# Altium project IC_tester.PrjPcb
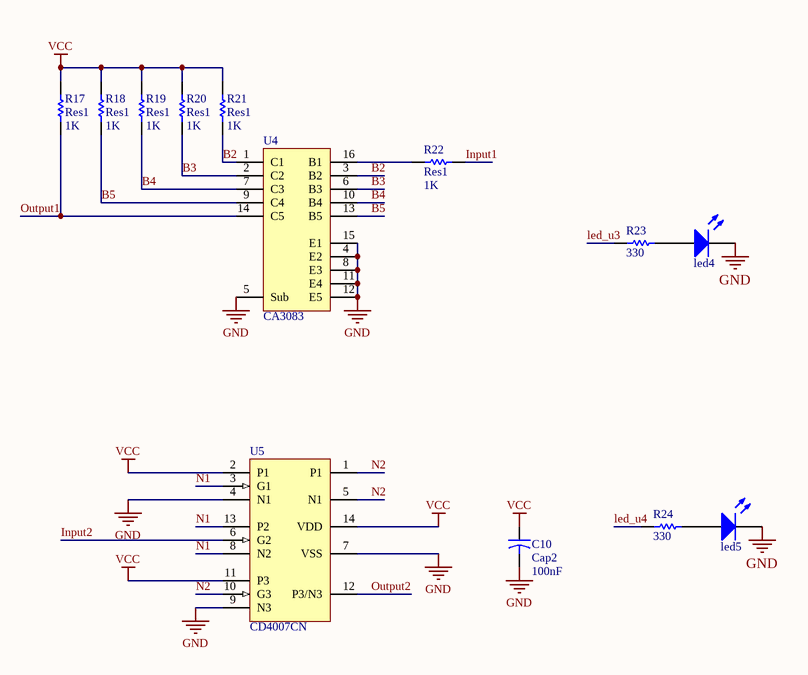
[diagram p0: Az_Proj.SchDoc]
3 sheets, 62 parts. Net scope: global (net labels, ports and power ports of the same name join across sheets).
Board file: ICtester.PcbDoc
Sheets:
  Az_Proj.SchDoc
  main.SchDoc
  power2.SchDoc

## Sheet Az_Proj.SchDoc
size A

### Parts
C10  Cap2  value 100nF  [My_cap100n]
led4  LED 5mm  [LED-5mm]  (value not drawn)
led5  LED 5mm  [LED-5mm]  (value not drawn)
R17  Res1  value 1K  [AXIAL-0.3]
R18  Res1  value 1K  [AXIAL-0.3]
R19  Res1  value 1K  [AXIAL-0.3]
R20  Res1  value 1K  [AXIAL-0.3]
R21  Res1  value 1K  [AXIAL-0.3]
R22  Res1  value 1K  [AXIAL-0.3]
R23  value 330  [AXIAL-0.3]  (hidden comment: Res1)
R24  value 330  [AXIAL-0.3]  (hidden comment: Res1)
U4  CA3083  [DIP16]
U5  CD4007CN  [DIP14]

### Nets
GND: C10.2 led4.2(K) led5.2(K) U4.4(E2) U4.5(Sub) U4.8(E3) U4.11(E4) U4.12(E5) U4.15(E1) U5.4(N1) U5.7(VSS) U5.9(N3)
VCC: C10.1 R17.2 R18.2 R19.2 R20.2 R21.2 U5.2(P1) U5.11(P3) U5.14(VDD)
B2: R21.1 U4.1(C1) U4.3(B2)
B3: R20.1 U4.2(C2) U4.6(B3)
B4: R19.1 U4.7(C3) U4.10(B4)
B5: R18.1 U4.9(C4) U4.13(B5)
Input1: R22.2
Input2: U5.6(G2)
led_u3: R23.1
led_u4: R24.1
N1: U5.3(G1) U5.8(N2) U5.13(P2)
N2: U5.1(P1) U5.5(N1) U5.10(G3)
Output1: R17.1 U4.14(C5)
Output2: U5.12(P3/N3)
Netled4_1: led4.1(A) R23.2
Netled5_1: led5.1(A) R24.2
NetR22_1: R22.1 U4.16(B1)

### Library data of the parts
C10 = Cap2: Capacitor; Published: 23-Sep-2002; PackageReference: CAPR5-4X5; Publisher: Altium Limited; PackageDescription: Capacitor; 2 Leads
led4 led5 = LED 5mm: Typical LED; Designer: Seyed Mohsen Ghasemian; Published: 07/31/2012; PackageReference: LED; Publisher: www.picpars.com; PackageDescription: LED; 2 Leads
R17-R24 = Res1: Resistor; Published: 8-Jun-2000; LatestRevisionDate: 17-Jul-2002; LatestRevisionNote: Re-released for DXP Platform.; PackageReference: AXIAL-0.3; Publisher: Altium Limited; PackageDescription: Axial Device, Thru-Hole; 2 Leads; 0.3 in Pin Spacing
U5 = CD4007CN: Dual Complementary Pair Plus Inverter; Published: 17-Jul-2002; LatestRevisionDate: 29-May-2009; LatestRevisionNote: Component Body Added.; DatasheetVersion: Jan-1999; PackageVersion: 2000; PackageReference: N14A; Publisher: Altium Limited; PackageDescription: DIP, 14-Pin, Row Spacing 7.62 mm, Pitch 2.54 mm; ComponentLink1Description: Manufacturer Link; ComponentLink1URL: http://www.fairchildsemi.com/

## Sheet main.SchDoc
size A
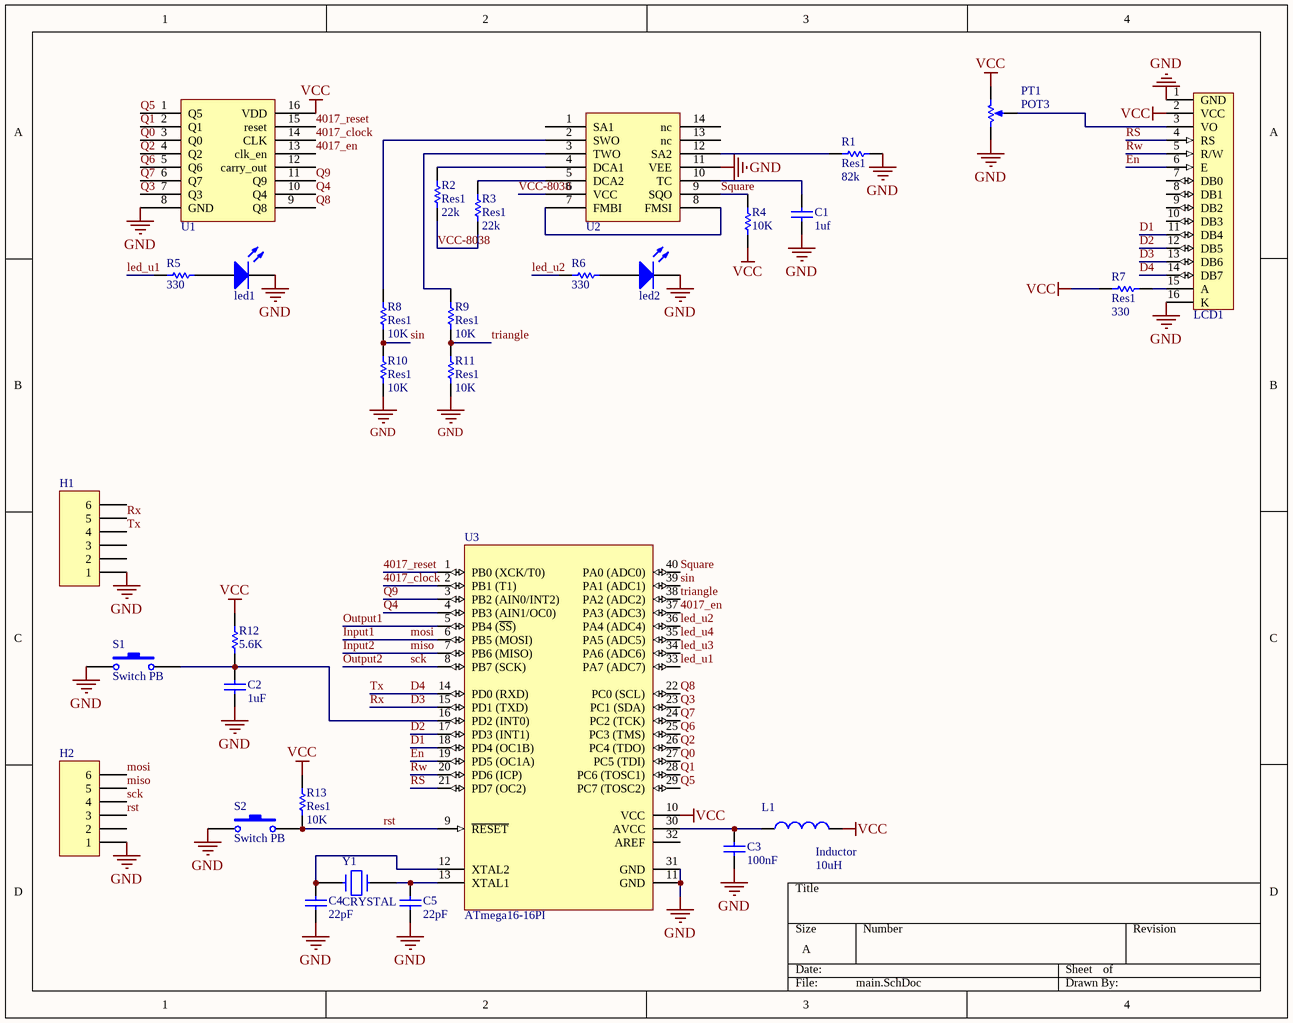
[diagram p1: main.SchDoc]

### Parts
C1  value 1uf  [My_cap100n]  (hidden comment: Cap-NF)
C2  value 1uF  [My_cap100n]  (hidden comment: Cap-NF)
C3  value 100nF  [My_cap100n]  (hidden comment: Cap-NF)
C4  value 22pF  [My_cap100n]  (hidden comment: Cap-NF)
C5  value 22pF  [My_cap100n]  (hidden comment: Cap-NF)
H1  Header 6  [My_1X06]  (value not drawn)
H2  Header 6  [My_1X06]  (value not drawn)
L1  Inductor  value 10uH  [AXIAL-0.4]
LCD1  LCD 16X2  [LCD 16x2]  (value not drawn)
led1  LED 5mm  [LED-5mm]  (value not drawn)
led2  LED 5mm  [LED-5mm]  (value not drawn)
PT1  POT3  [POT3]
R1  Res1  value 82k  [AXIAL-0.3]
R2  Res1  value 22k  [AXIAL-0.3]
R3  Res1  value 22k  [AXIAL-0.3]
R4  value 10K  [AXIAL-0.3]  (hidden comment: Res1)
R5  value 330  [AXIAL-0.3]  (hidden comment: Res1)
R6  value 330  [AXIAL-0.3]  (hidden comment: Res1)
R7  Res1  value 330  [AXIAL-0.3]
R8  Res1  value 10K  [AXIAL-0.3]
R9  Res1  value 10K  [AXIAL-0.3]
R10  Res1  value 10K  [AXIAL-0.3]
R11  Res1  value 10K  [AXIAL-0.3]
R12  value 5.6K  [AXIAL-0.3]  (hidden comment: Res1)
R13  Res1  value 10K  [AXIAL-0.3]
S1  Switch PB  [Switch - Push to On]
S2  Switch PB  [Switch - Push to On]
U1  4017  [DIP16]  (value not drawn)
U2  xr8038  [DIP14]  (value not drawn)
U3  ATmega16-16PI  [My_40P6]
Y1  CRYSTAL  [My_Crystal]

### Nets
GND: C1.1 C2.1 C3.2 C4.2 C5.2 H1.1 H2.1 LCD1.1(GND) LCD1.16(K) led1.2(K) led2.2(K) PT1.2(BOT) R1.2 R10.1 R11.1 S1.1 S2.1 U1.8(GND) U2.11(VEE) U3.11(GND) U3.31(GND)
VCC: L1.2 LCD1.2(VCC) PT1.1(TOP) R4.1 R7.1 R12.1 R13.2 U1.16(VDD) U3.10(VCC)
4017_clock: U1.14(CLK) U3.2(PB1_(T1))
4017_en: U1.13(clk_en) U3.37(PA3_(ADC3))
4017_reset: U1.15(reset) U3.1(PB0_(XCK/T0))
D1: LCD1.11(DB4) U3.18(PD4_(OC1B))
D2: LCD1.12(DB5) U3.17(PD3_(INT1))
D3: H1.5 LCD1.13(DB6) U3.15(PD1_(TXD))  [also labelled Rx]
D4: H1.4 LCD1.14(DB7) U3.14(PD0_(RXD))  [also labelled Tx]
En: LCD1.6(E) U3.19(PD5_(OC1A))
Input1: H2.6 U3.6(PB5_(MOSI))  [also labelled mosi]
Input2: H2.5 U3.7(PB6_(MISO))  [also labelled miso]
led_u1: R5.1 U3.33(PA7_(ADC7))
led_u2: R6.1 U3.36(PA4_(ADC4))
led_u3: U3.34(PA6_(ADC6))
led_u4: U3.35(PA5_(ADC5))
Output1: U3.5(PB4_(~{SS}))
Output2: H2.4 U3.8(PB7_(SCK))  [also labelled sck]
Q0: U1.3(Q0) U3.27(PC5_(TDI))
Q1: U1.2(Q1) U3.28(PC6_(TOSC1))
Q2: U1.4(Q2) U3.26(PC4_(TDO))
Q3: U1.7(Q3) U3.23(PC1_(SDA))
Q4: U1.10(Q4) U3.4(PB3_(AIN1/OC0))
Q5: U1.1(Q5) U3.29(PC7_(TOSC2))
Q6: U1.5(Q6) U3.25(PC3_(TMS))
Q7: U1.6(Q7) U3.24(PC2_(TCK))
Q8: U1.9(Q8) U3.22(PC0_(SCL))
Q9: U1.11(Q9) U3.3(PB2_(AIN0/INT2))
RS: LCD1.4(RS) U3.21(PD7_(OC2))
rst: H2.3 R13.1 S2.2 U3.9(~{RESET})
Rw: LCD1.5(R/W) U3.20(PD6_(ICP))
sin: R8.1 R10.2 U3.39(PA1_(ADC1))
Square: R4.2 U2.9(SQO) U3.40(PA0_(ADC0))
triangle: R9.1 R11.2 U3.38(PA2_(ADC2))
VCC-8038: R2.1 R3.1 U2.6(VCC)
NetC1_2: C1.2 U2.10(TC)
NetC2_2: C2.2 R12.2 S1.2 U3.16(PD2_(INT0))
NetC3_1: C3.1 L1.1 U3.30(AVCC)
NetC4_1: C4.1 U3.12(XTAL2) Y1.1
NetC5_1: C5.1 U3.13(XTAL1) Y1.2
NetLCD1_3: LCD1.3(VO) PT1.3(TAP)
NetLCD1_15: LCD1.15(A) R7.2
Netled1_1: led1.1(A) R5.2
Netled2_1: led2.1(A) R6.2
NetR1_1: R1.1 U2.12(SA2)
NetR2_2: R2.2 U2.4(DCA1)
NetR3_2: R3.2 U2.5(DCA2)
NetR8_2: R8.2 U2.2(SWO)
NetR9_2: R9.2 U2.3(TWO)
NetU2_7: U2.7(FMBI) U2.8(FMSI)

Not connected (* = marked no-connect by the designer): H1 2 3 6; H2 2; LCD1 7(DB0) 8(DB1) 9(DB2) 10(DB3); U1 12(carry_out); U2 1(SA1) 13(nc) 14(nc); U3 32(AREF)

### Library data of the parts
C1-C5 = Cap-NF: Capacitor; Published: 8-Jun-2000; LatestRevisionDate: 17-Jul-2002; LatestRevisionNote: Re-released for DXP Platform.; PackageReference: RAD-0.3; Publisher: Altium Limited
H1 H2 = Header 6: Header, 6-Pin; LatestRevisionDate: 17-Jul-2002; LatestRevisionNote: Re-released for DXP Platform.; Publisher: Altium Limited
L1 = Inductor: Code_IEC: 1005; Published: 8-Jun-2000; LatestRevisionDate: 29-May-2009; LatestRevisionNote: IPC-7351 Footprint Added.; PackageReference: 0402-A; Publisher: Altium Limited; PackageDescription: Chip Inductor; Code_JEITA: 0402
LCD1 = LCD 16X2: LCD 16X2 Character lcd
led1 led2 = LED 5mm: as led4 on sheet Az_Proj; Published: 07/31/2012; PackageReference: LED; Publisher: www.picpars.com; PackageDescription: LED; 2 Leads
PT1 = POT3: Variable Potentiometer top adjust; Designer: Seyed Mohsen Ghasemian; WEB: www.picpars.com
R1-R13 = Res1: Resistor; Published: 8-Jun-2000; LatestRevisionDate: 17-Jul-2002; LatestRevisionNote: Re-released for DXP Platform.; PackageReference: AXIAL-0.3; Publisher: Altium Limited; PackageDescription: Axial Device, Thru-Hole; 2 Leads; 0.3 in Pin Spacing
S1 S2 = Switch PB: Push Button Switch
U3 = ATmega16-16PI: AVR 16K Bytes of In-System Programmable Flash Memory; Published: 17-Sep-2003; LatestRevisionDate: 04-Mar-2005; LatestRevisionNote: Stylized 3D Model Added.; DatasheetVersion: 2466E-AVR-10/02; PackageVersion: Dec-1999; PackageReference: 40P6; Publisher: Altium Limited; PackageDescription: DIP; 40 Leads; Row Spacing 15.24 mm; Pitch 2.54 mm; ComponentLink1Description: Manufacturer Link; ComponentLink1URL: http://www.atmel.com; ComponentLink2Description: Datasheet; ComponentLink2URL: http://www.atmel.com/dyn/resources/prod_documents/doc2466.pdf

## Sheet power2.SchDoc
size A
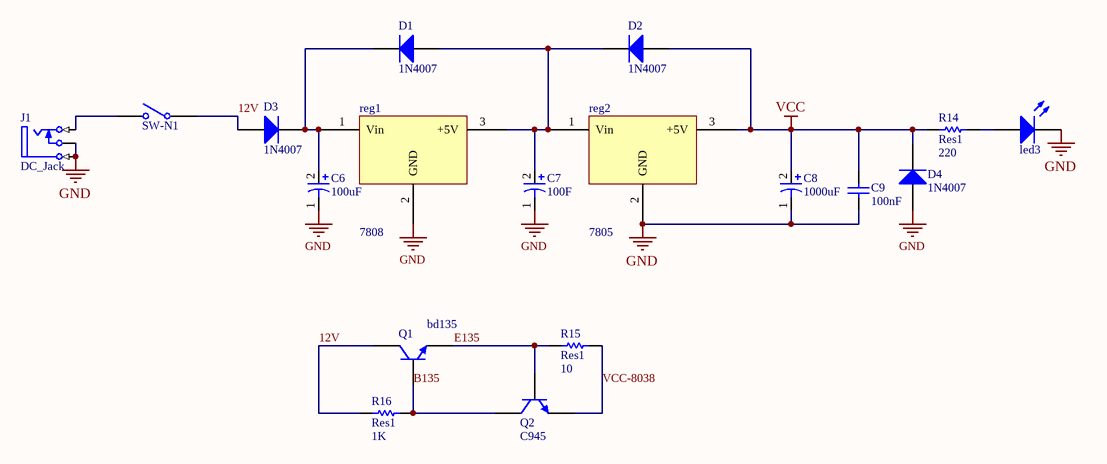
[diagram p2: power2.SchDoc]

### Parts
C6  value 100uF  [Cap-Polar-5.5mm]  (hidden comment: Cap-Polar)
C7  value 100F  [Cap-Polar-5.5mm]  (hidden comment: Cap-Polar)
C8  value 1000uF  [Cap-Polar-10.5mm]  (hidden comment: Cap-Polar)
C9  value 100nF  [My_cap100n]  (hidden comment: Cap-NF)
D1  1N4007  [DO-41]
D2  1N4007  [DO-41]
D3  1N4007  [DO-41]
D4  1N4007  [DO-41]
J1  DC_Jack  [Power Jack]
led3  LED 5mm  [LED-5mm]  (value not drawn)
Q1  bd135  [SOT-32]
Q2  C945  [C945]
R14  Res1  value 220  [AXIAL-0.3]
R15  Res1  value 10  [AXIAL-0.3]
R16  Res1  value 1K  [AXIAL-0.3]
reg1  7808  [REG-7805-smd]
reg2  7805  [REG-7805-smd]
SW-N1  Switch-1 way  [rocker - switch]  (value not drawn)

### Nets
GND: C6.1 C7.1 C8.1 C9.2 D4.A J1.2(TN) J1.3(S) led3.2(K) reg1.2(GND) reg2.2(GND)
VCC: C8.2 C9.1 D2.A D4.K R14.1 reg2.3(+5V)
12V: D3.A Q1.2(C) R16.1 SW-N1.1(COMMON)
B135: Q1.3(B) Q2.2(C) R16.2
E135: Q1.1(E) Q2.3(B) R15.1
VCC-8038: Q2.1(E) R15.2
NetC6_2: C6.2 D1.K D3.K reg1.1(Vin)
NetC7_2: C7.2 D1.A D2.K reg1.3(+5V) reg2.1(Vin)
NetJ1_1: J1.1(T) SW-N1.2(NO)
Netled3_1: led3.1(A) R14.2

### Library data of the parts
C6-C8 = Cap-Polar: Polarized Capacitor (Axial); Published: 8-Jun-2000; LatestRevisionDate: 17-Jul-2002; LatestRevisionNote: Re-released for DXP Platform.; PackageReference: POLAR0.8; Publisher: Altium Limited
C9 = Cap-NF: Capacitor; Published: 8-Jun-2000; LatestRevisionDate: 17-Jul-2002; LatestRevisionNote: Re-released for DXP Platform.; PackageReference: RAD-0.3; Publisher: Altium Limited
D1-D4 = 1N4007: 1 Amp Diode; pin to pad: A>1 K>2
J1 = DC_Jack: PackageDocument: 2003; PCB_Layout: Complies with manufacturer's recommendation.; DrillAndSlotSize: Corresponds to nominal value.; LatestRevisionDate: 15-Jul-2004; LatestRevisionNote: Component Replaced & renamed from "Phonejack".; DatasheetDocument: 2003; PackageReference: S1VS_SNB; Publisher: Altium Limited; ComponentLink1Description: Manufacturer Link; ComponentLink1URL: http://www.cliffuk.co.uk/
led3 = LED 5mm: as led4 on sheet Az_Proj; Published: 07/31/2012; PackageReference: LED; Publisher: www.picpars.com; PackageDescription: LED; 2 Leads
Q1 = C945: NPN Transistor; pin to pad: 1>B 2>C 3>E; Designer: Saeid Jorablo; Company: IPA CO; Last Update Time: 2008/08/04; Value: bd135
Q2 = C945: NPN Transistor; Designer: Saeid Jorablo; Company: IPA CO; Last Update Time: 2008/08/04; Value: C945
R14-R16 = Res1: Resistor; Published: 8-Jun-2000; LatestRevisionDate: 17-Jul-2002; LatestRevisionNote: Re-released for DXP Platform.; PackageReference: AXIAL-0.3; Publisher: Altium Limited; PackageDescription: Axial Device, Thru-Hole; 2 Leads; 0.3 in Pin Spacing
reg1 reg2 = 7805: Regulator

## Nets that join several sheets
GND: Az_Proj (12 pins), main (21 pins), power2 (10 pins)
VCC: Az_Proj (9 pins), main (9 pins), power2 (6 pins)
Input1: Az_Proj (R22.2), main (H2.6 U3.6)
Input2: Az_Proj (U5.6), main (H2.5 U3.7)
led_u3: Az_Proj (R23.1), main (U3.34)
led_u4: Az_Proj (R24.1), main (U3.35)
Output1: Az_Proj (R17.1 U4.14), main (U3.5)
Output2: Az_Proj (U5.12), main (H2.4 U3.8)
VCC-8038: main (R2.1 R3.1 U2.6), power2 (Q2.1 R15.2)